# EAGLE design Midi2CV (EAGLE 6.2)
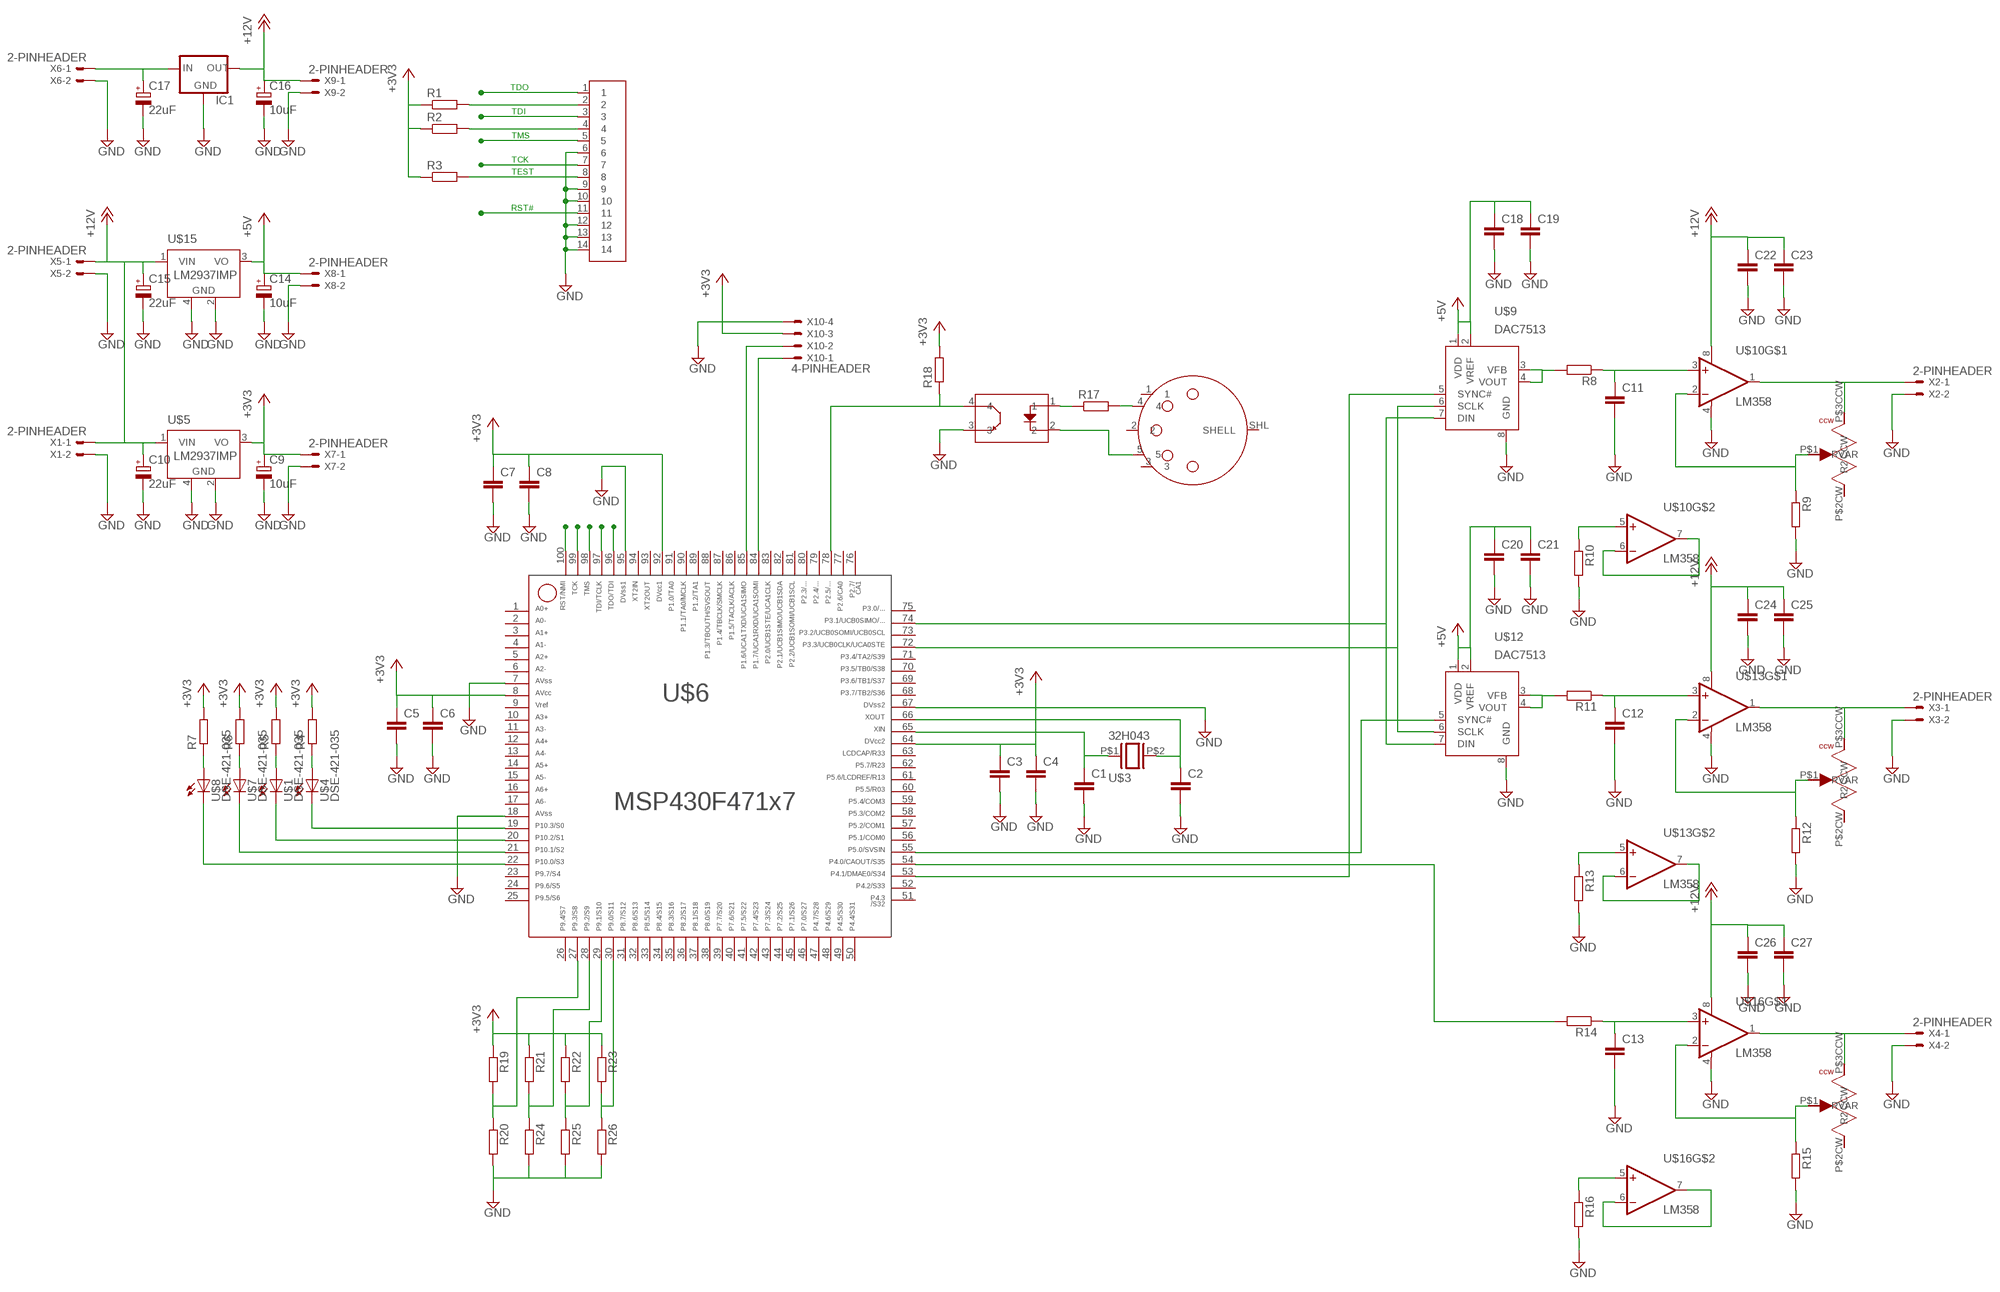
[diagram p0: schematic, sheet 1]

## Parts
C1  C-EUC0402  [C0402]
C2  C-EUC0402  [C0402]
C3  C-EUC0402  [C0402]
C4  C-EUC0402  [C0402]
C5  C-EUC0402  [C0402]
C6  C-EUC0402  [C0402]
C7  C-EUC0402  [C0402]
C8  C-EUC0402  [C0402]
C9  10uF  CPOL-EUSMCC  [SMC_C]
C10  22uF  CPOL-EUSMCD  [SMC_D]
C11  C-EUC0402  [C0402]
C12  C-EUC0402  [C0402]
C13  C-EUC0402  [C0402]
C14  10uF  CPOL-EUSMCC  [SMC_C]
C15  22uF  CPOL-EUSMCD  [SMC_D]
C16  10uF  CPOL-EUSMCC  [SMC_C]
C17  22uF  CPOL-EUSMCD  [SMC_D]
C18  C-EUC0402  [C0402]
C19  C-EUC0402  [C0402]
C20  C-EUC0402  [C0402]
C21  C-EUC0402  [C0402]
C22  C-EUC0402  [C0402]
C23  C-EUC0402  [C0402]
C24  C-EUC0402  [C0402]
C25  C-EUC0402  [C0402]
C26  C-EUC0402  [C0402]
C27  C-EUC0402  [C0402]
IC1  78MXXS  [78MXXS]
R1  R-EU_R0402  [R0402]
R2  R-EU_R0402  [R0402]
R3  R-EU_R0402  [R0402]
R4  R-EU_R0402  [R0402]
R5  R-EU_R0402  [R0402]
R6  R-EU_R0402  [R0402]
R7  R-EU_R0402  [R0402]
R8  R-EU_R0402  [R0402]
R9  R-EU_R0402  [R0402]
R10  R-EU_R0402  [R0402]
R11  R-EU_R0402  [R0402]
R12  R-EU_R0402  [R0402]
R13  R-EU_R0402  [R0402]
R14  R-EU_R0402  [R0402]
R15  R-EU_R0402  [R0402]
R16  R-EU_R0402  [R0402]
R17  R-EU_R1206  [R1206]
R18  R-EU_R1206  [R1206]
R19  R-EU_R0402  [R0402]
R20  R-EU_R0402  [R0402]
R21  R-EU_R0402  [R0402]
R22  R-EU_R0402  [R0402]
R23  R-EU_R0402  [R0402]
R24  R-EU_R0402  [R0402]
R25  R-EU_R0402  [R0402]
R26  R-EU_R0402  [R0402]
U$1  DSE-421-035  [2432]
U$2  2X7SMD_HEADER  [2X14SMDPADS]
U$3  32H043  [XTAL-SMALL-4]
U$4  DSE-421-035  [2432]
U$5  LM2937IMP  [SOT223]
U$6  F471X7---PZ100  [PZ100]
U$7  DSE-421-035  [2432]
U$8  DSE-421-035  [2432]
U$9  DAC7513  [MSOP08]
U$10  LM358  [SO08]
U$11  SMD-POT  [POT_PADS]
U$12  DAC7513  [MSOP08]
U$13  LM358  [SO08]
U$14  SMD-POT  [POT_PADS]
U$15  LM2937IMP  [SOT223]
U$16  LM358  [SO08]
U$17  SMD-POT  [POT_PADS]
U$19  F2801A  [LONG_TSOP]
U$20  MIDI_VERT  [DIN-5_VERT]
X1  2-PINHEADER  [22-23-2021]
X2  2-PINHEADER  [22-23-2021]
X3  2-PINHEADER  [22-23-2021]
X4  2-PINHEADER  [22-23-2021]
X5  2-PINHEADER  [22-23-2021]
X6  2-PINHEADER  [22-23-2021]
X7  2-PINHEADER  [22-23-2021]
X8  2-PINHEADER  [22-23-2021]
X9  2-PINHEADER  [22-23-2021]
X10  4-PINHEADER  [22-23-2041]

## Nets
+3V3: C3.1 C4.1 C5.1 C6.1 C7.1 C8.1 C9.+ R1.1 R2.1 R3.1 R4.2 R5.2 R6.2 R7.2 R18.2 R19.1 R21.1 R22.1 R23.1 U$5.3(VO) U$6.8 U$6.64 U$6.92 X7.1 X10.3
+5V: C14.+ C18.1 C19.1 C20.1 C21.1 U$9.1(VDD) U$9.2(VREF) U$12.1(VDD) U$12.2(VREF) U$15.3(VO) X8.1
+12V: C10.+ C15.+ C16.+ C22.1 C23.1 C24.1 C25.1 C26.1 C27.1 IC1.OUT U$5.1(VIN) U$10.8(V+) U$13.8(V+) U$15.1(VIN) U$16.8(V+) X1.1 X5.1 X9.1
GND: C1.2 C2.2 C3.2 C4.2 C5.2 C6.2 C7.2 C8.2 C9.- C10.- C11.2 C12.2 C13.2 C14.- C15.- C16.- C17.- C18.2 C19.2 C20.2 C21.2 C22.2 C23.2 C24.2 C25.2 C26.2 C27.2 IC1.GND R9.2 R10.2 R12.2 R13.2 R15.2 R16.2 R20.2 R24.2 R25.2 R26.2 U$2.6 U$2.9 U$2.10 U$2.12 U$2.13 U$2.14 U$5.2(GND) U$5.4(GND) U$6.7 U$6.18 U$6.67 U$6.95 U$9.8(GND) U$10.4(V-) U$12.8(GND) U$13.4(V-) U$15.2(GND) U$15.4(GND) U$16.4(V-) U$19.3 X1.2 X2.2 X3.2 X4.2 X5.2 X6.2 X7.2 X8.2 X9.2 X10.4
N$1: R1.2 U$2.2
N$2: C1.1 U$3.P$1 U$6.65
N$3: C2.1 U$3.P$2 U$6.66
N$4: R2.2 U$2.4
N$5: U$6.22 U$8.MARKED(C)
N$6: U$6.21 U$7.MARKED(C)
N$7: U$1.MARKED(C) U$6.20
N$8: U$4.MARKED(C) U$6.19
N$9: R7.1 U$8.P$1(A)
N$10: R6.1 U$7.P$1(A)
N$11: R5.1 U$1.P$1(A)
N$12: R4.1 U$4.P$1(A)
N$13: U$6.84 X10.1
N$14: R8.2 U$9.3(VFB) U$9.4(VOUT)
N$15: U$10.6(-IN) U$10.7(OUT)
N$16: C11.1 R8.1 U$10.3(+IN)
N$17: R9.1 U$10.2(-IN) U$11.P$1(RVAR)
N$18: U$10.1(OUT) U$11.P$3CCW(CCW) X2.1
N$19: R11.2 U$12.3(VFB) U$12.4(VOUT)
N$20: R10.1 U$10.5(+IN)
N$21: U$13.6(-IN) U$13.7(OUT)
N$22: C12.1 R11.1 U$13.3(+IN)
N$23: R12.1 U$13.2(-IN) U$14.P$1(RVAR)
N$24: U$13.1(OUT) U$14.P$3CCW(CCW) X3.1
N$25: R13.1 U$13.5(+IN)
N$26: R14.2 U$6.54
N$27: U$16.6(-IN) U$16.7(OUT)
N$28: C13.1 R14.1 U$16.3(+IN)
N$29: R15.1 U$16.2(-IN) U$17.P$1(RVAR)
N$30: U$16.1(OUT) U$17.P$3CCW(CCW) X4.1
N$31: R16.1 U$16.5(+IN)
N$32: U$6.85 X10.2
N$34: U$6.72 U$9.6(SCLK) U$12.6(SCLK)
N$35: U$6.74 U$9.7(DIN) U$12.7(DIN)
N$36: R17.2 U$20.4
N$37: U$6.53 U$9.5(SYNC#)
N$38: U$6.55 U$12.5(SYNC#)
N$39: R17.1 U$19.1
N$40: U$19.2 U$20.5
N$41: R18.1 U$6.78 U$19.4
N$42: C17.+ IC1.IN X6.1
N$43: R19.2 R20.1 U$6.27
N$44: R21.2 R24.1 U$6.28
N$45: R22.2 R25.1 U$6.29
N$46: R23.2 R26.1 U$6.30
RST#: U$2.11 U$6.100
TCK: U$2.7 U$6.99
TDI: U$2.3 U$6.97
TDO: U$2.1 U$6.96
TEST: R3.2 U$2.8
TMS: U$2.5 U$6.98
Unconnected: U$6.1 U$6.2 U$6.3 U$6.4 U$6.5 U$6.6 U$6.9 U$6.10 U$6.11 U$6.12 U$6.13 U$6.14 U$6.15 U$6.16 U$6.17 U$6.23 U$6.24 U$6.25 U$6.26 U$6.31 U$6.32 U$6.33 U$6.34 U$6.35 U$6.36 U$6.37 U$6.38 U$6.39 U$6.40 U$6.41 U$6.42 U$6.43 U$6.44 U$6.45 U$6.46 U$6.47 U$6.48 U$6.49 U$6.50 U$6.51 U$6.52 U$6.56 U$6.57 U$6.58 U$6.59 U$6.60 U$6.61 U$6.62 U$6.63 U$6.68 U$6.69 U$6.70 U$6.71 U$6.73 U$6.75 U$6.76 U$6.77 U$6.79 U$6.80 U$6.81 U$6.82 U$6.83 U$6.86 U$6.87 U$6.88 U$6.89 U$6.90 U$6.91 U$6.93 U$6.94 U$11.P$2CW(R2) U$14.P$2CW(R2) U$17.P$2CW(R2) U$20.1 U$20.2 U$20.3 U$20.SHL(SHELL)

## Notes on the sheet
- TDO
- TDI
- TMS
- TCK
- TEST
- RST#

## Library data of the parts
C1-C8 C11-C13 C18-C27 = rcl:C-EU: CAPACITOR, European symbol
C9 C10 C14-C17 = rcl:CPOL-EU: POLARIZED CAPACITOR, European symbol
IC1 = v-reg:78MXXS: VOLTAGE REGULATOR
R1-R26 = rcl:R-EU_: RESISTOR, European symbol
U$1 U$4 U$7 U$8 = synth_design:DSE-421-035
U$2 = synth_design:2X7SMD_HEADER
U$3 = synth_design:32H043
U$5 U$15 = synth_design:LM2937IMP
U$6 = TI_MSP430_v16:F471X7---PZ100: ***MSP430F471x7***PZ100
U$9 U$12 = synth_design:DAC7513
U$10 U$13 U$16 = synth_design:LM358
U$11 U$14 U$17 = synth_design:SMD-POT
U$19 = synth_design:F2801A
U$20 = synth_design:MIDI_VERT
X1-X9 = Custom_headers:2-PINHEADER: .100" (2.54mm) Center Header - 2 Pin; MF: MOLEX; MPN: 22-23-2021; OC_FARNELL: 1462926; OC_NEWARK: 25C3832
X10 = Custom_headers:4-PINHEADER: .100" (2.54mm) Center Header - 4 Pin; MF: MOLEX; MPN: 22-23-2041; OC_FARNELL: 1462920; OC_NEWARK: 38C0355

## Board
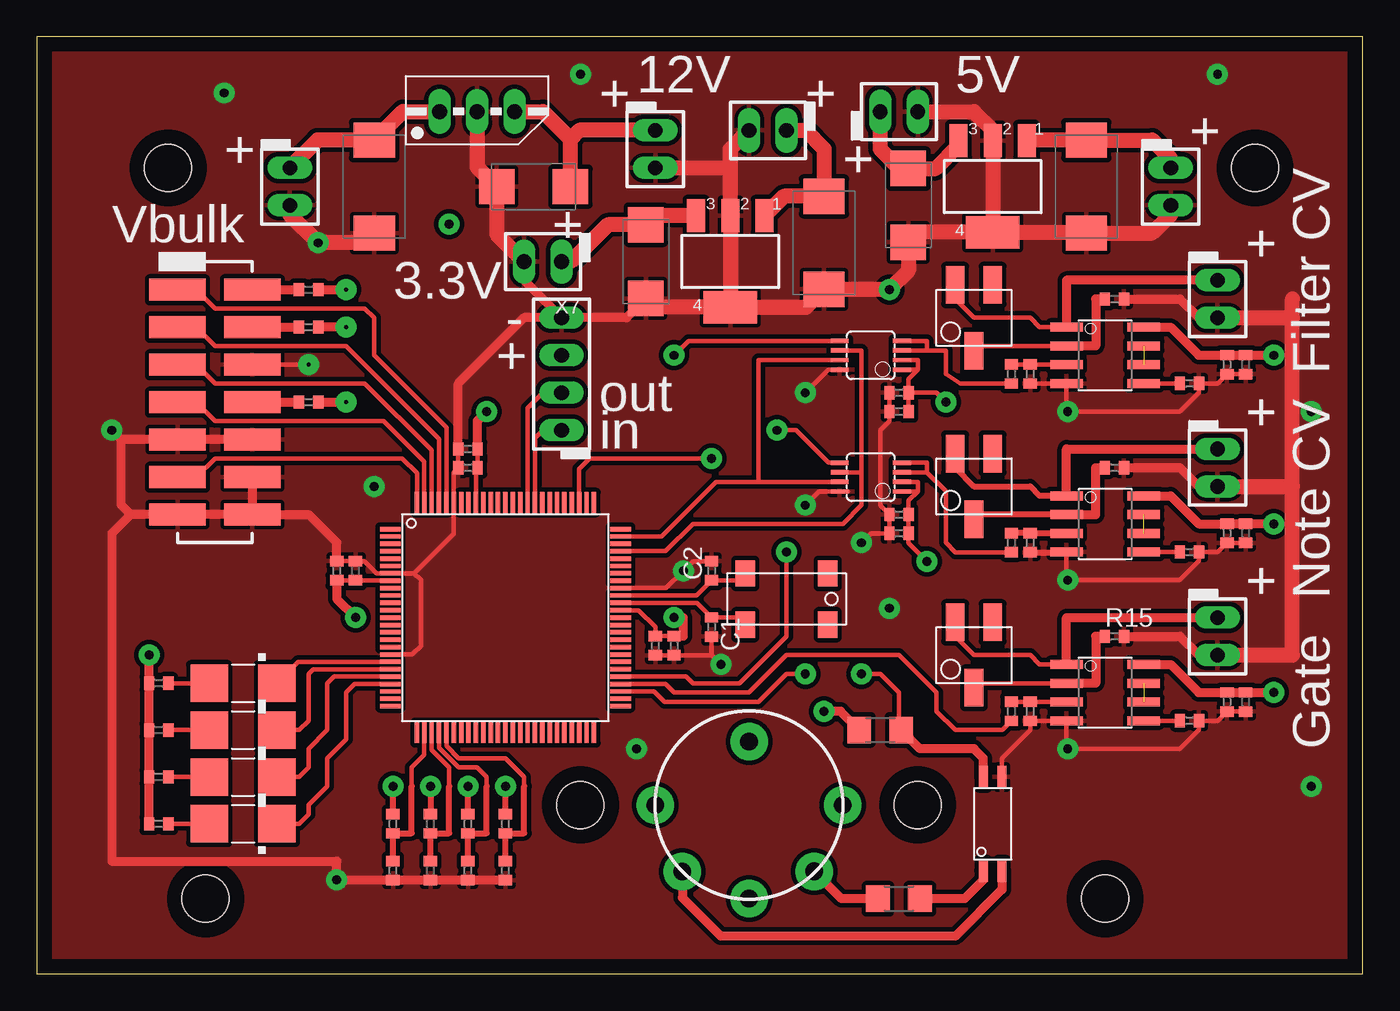
[diagram p1: board, top side]
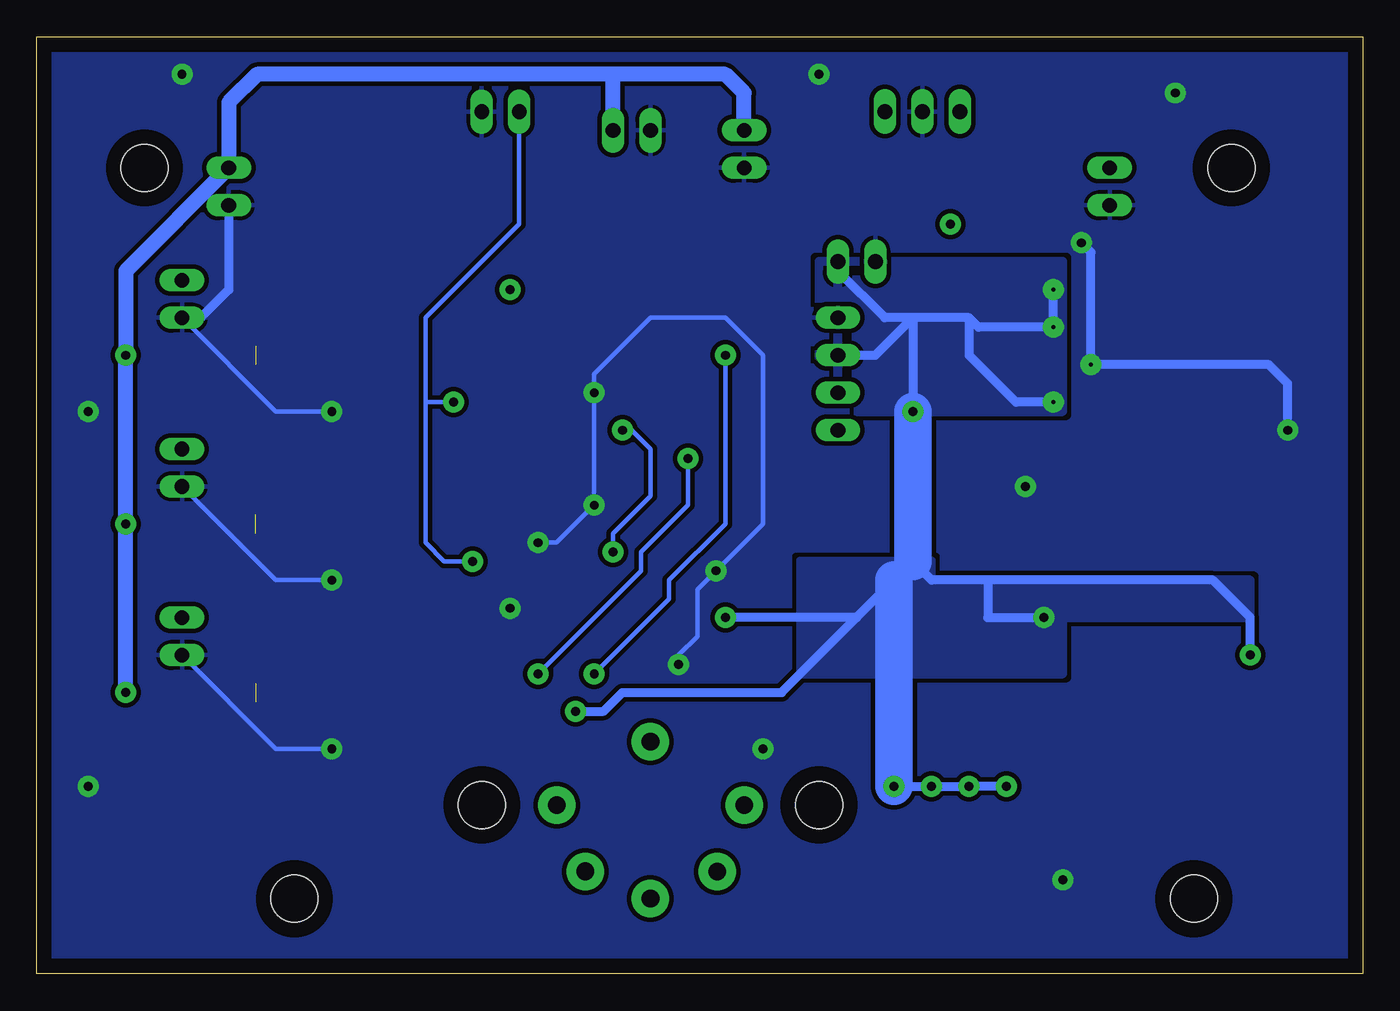
[diagram p2: board, bottom side, seen from below]

Size 89.84 x 63.49 mm. Coordinates in mm from the lower left corner, seen from the top.
Outline: 0,0 89.84,0 89.84,63.49 0,63.49 0,0
Copper layers (1*16): Top 0.035mm / dielectric 1.5mm / Bottom 0.035mm
Design rules: minimum track width 10mil, minimum drill 24mil, track to track 12mil, track to pad 12mil, pad to pad 12mil, via to via 12mil, smd to smd 12mil, copper to edge 40mil, drill to drill 8mil, minimum pad ring 10mil, minimum via ring 8mil, stop-mask expansion 4mil, vias tented up to drill 0mil, thermal gap 10mil
Holes 3.17 mm at 8.89,54.61 72.39,5.08 36.83,11.43 11.43,5.08 59.69,11.43 82.55,54.61

### Footprints (pad centres in the part's own frame; a part is rotated, then mirrored left to right if it is on the bottom)
C0402 = smd 0.7 x 0.9: 1 -0.65,0; 2 0.65,0
SMC_C = smd 2.4 x 2.4: + -2.5,0; - 2.5,0
SMC_D = smd 2.4 x 2.8: + -3.15,0; - 3.15,0
78MXXS = drill 1.016 long: GND 0,-2.54; IN -2.54,-2.54; OUT 2.54,-2.54
R0402 = smd 0.7 x 0.9: 1 -0.65,0; 2 0.65,0
R1206 = smd 1.6 x 1.803: 1 -1.422,0; 2 1.422,0
2432 = smd 2.54 x 2.54: MARKED 2.286,0; P$1 -2.286,0
2X14SMDPADS = smd 3.81 x 1.499: 1 -2.54,7.62; 2 2.54,7.62; 3 -2.54,5.08; 4 2.54,5.08; 5 -2.54,2.54; 6 2.54,2.54; 7 -2.54,0; 8 2.54,0; 9 -2.54,-2.54; 10 2.54,-2.54; 11 -2.54,-5.08; 12 2.54,-5.08; 13 -2.54,-7.62; 14 2.54,-7.62
XTAL-SMALL-4 = smd 1.778 x 1.295: NC1 -1.753,-2.794; NC2 1.727,-2.794; P$1 -1.753,2.794; P$2 1.727,2.794
SOT223 = smd 1.219 x 2.235: 1 -2.311,-3.099; 2 0,-3.099; 3 2.311,-3.099 | smd 3.6 x 2.2: 4 0,3.099
PZ100 = smd 1.4 x 0.3: 1 -7.8,6; 2 -7.8,5.5; 3 -7.8,5; 4 -7.8,4.5; 5 -7.8,4; 6 -7.8,3.5; 7 -7.8,3; 8 -7.8,2.5; 9 -7.8,2; 10 -7.8,1.5; 11 -7.8,1; 12 -7.8,0.5; 13 -7.8,0; 14 -7.8,-0.5; 15 -7.8,-1; 16 -7.8,-1.5; 17 -7.8,-2; 18 -7.8,-2.5; 19 -7.8,-3; 20 -7.8,-3.5; 21 -7.8,-4; 22 -7.8,-4.5; 23 -7.8,-5; 24 -7.8,-5.5; 25 -7.8,-6; 51 7.8,-6; 52 7.8,-5.5; 53 7.8,-5; 54 7.8,-4.5; 55 7.8,-4; 56 7.8,-3.5; 57 7.8,-3; 58 7.8,-2.5; 59 7.8,-2; 60 7.8,-1.5; 61 7.8,-1; 62 7.8,-0.5; 63 7.8,0; 64 7.8,0.5; 65 7.8,1; 66 7.8,1.5; 67 7.8,2; 68 7.8,2.5; 69 7.8,3; 70 7.8,3.5; 71 7.8,4; 72 7.8,4.5; 73 7.8,5; 74 7.8,5.5; 75 7.8,6 | smd 0.3 x 1.4: 26 -6,-7.8; 27 -5.5,-7.8; 28 -5,-7.8; 29 -4.5,-7.8; 30 -4,-7.8; 31 -3.5,-7.8; 32 -3,-7.8; 33 -2.5,-7.8; 34 -2,-7.8; 35 -1.5,-7.8; 36 -1,-7.8; 37 -0.5,-7.8; 38 0,-7.8; 39 0.5,-7.8; 40 1,-7.8; 41 1.5,-7.8; 42 2,-7.8; 43 2.5,-7.8; 44 3,-7.8; 45 3.5,-7.8; 46 4,-7.8; 47 4.5,-7.8; 48 5,-7.8; 49 5.5,-7.8; 50 6,-7.8; 76 6,7.8; 77 5.5,7.8; 78 5,7.8; 79 4.5,7.8; 80 4,7.8; 81 3.5,7.8; 82 3,7.8; 83 2.5,7.8; 84 2,7.8; 85 1.5,7.8; 86 1,7.8; 87 0.5,7.8; 88 0,7.8; 89 -0.5,7.8; 90 -1,7.8; 91 -1.5,7.8; 92 -2,7.8; 93 -2.5,7.8; 94 -3,7.8; 95 -3.5,7.8; 96 -4,7.8; 97 -4.5,7.8; 98 -5,7.8; 99 -5.5,7.8; 100 -6,7.8
MSOP08 = smd 0.3 x 1.2: 1 -0.976,-2.113; 2 -0.326,-2.113; 3 0.324,-2.113; 4 0.974,-2.113; 5 0.974,2.112; 6 0.324,2.112; 7 -0.326,2.112; 8 -0.976,2.112
SO08 = smd 0.61 x 2.21: 1 -1.905,-2.616; 2 -0.635,-2.616; 3 0.635,-2.616; 4 1.905,-2.616; 5 1.905,2.616; 6 0.635,2.616; 7 -0.635,2.616; 8 -1.905,2.616
POT_PADS = smd 2.54 x 1.27: P$1 2.223,0; P$2CW -2.223,1.27; P$3CCW -2.223,-1.27
LONG_TSOP = smd 1.524 x 0.61: 1 -3.175,0.635; 2 -3.175,-0.635; 3 3.175,-0.635; 4 3.175,0.635
DIN-5_VERT = drill 1.2 pad 2.54: 1 0,-6.35; 2 -6.35,0; 3 0,6.35; 4 -4.496,-4.42; 5 -4.521,4.521; SHL 4.293,0
22-23-2021 = drill 1 long: 1 -1.27,0; 2 1.27,0
22-23-2041 = drill 1 long: 1 -3.81,0; 2 -1.27,0; 3 1.27,0; 4 3.81,0

### Placement (x,y rotation side)
C1  45.72,23.5 270 top
C2  45.72,27.3 90 top
C3  41.91,22.23 270 top
C4  43.18,22.23 270 top
C5  20.32,27.3 90 top
C6  21.59,27.3 90 top
C7  29.21,35.56 180 top
C8  29.21,34.29 180 top
C9  41.27,48.26 270 top
C10  53.34,49.53 270 top
C11  67.31,40.64 270 top
C12  67.31,29.21 270 top
C13  67.31,17.78 270 top
C14  59.05,52.07 270 top
C15  71.12,53.34 270 top
C16  33.66,53.34 180 top
C17  22.86,53.34 270 top
C18  58.42,31.11 180 top
C19  58.42,29.84 180 top
C20  58.42,38.1 180 top
C21  58.42,39.37 180 top
C22  80.64,41.27 270 top
C23  81.92,41.27 270 top
C24  80.64,29.84 270 top
C25  81.92,29.84 270 top
C26  80.64,18.41 270 top
C27  81.92,18.41 270 top
IC1  29.84,60.96 0 top
R1  18.41,46.35 180 top
R2  18.41,43.81 180 top
R3  18.41,38.73 180 top
R4  8.26,19.68 180 top
R5  8.26,16.51 180 top
R6  8.26,13.34 180 top
R7  8.26,10.16 180 top
R8  66.04,40.64 270 top
R9  73.03,45.72 0 top
R10  78.11,40.01 0 top
R11  66.04,29.21 270 top
R12  73.03,34.29 0 top
R13  78.11,28.57 0 top
R14  66.04,17.78 270 top
R15  73.03,22.86 0 top
R16  78.11,17.14 0 top
R17  58.42,5.08 180 top
R18  57.15,16.51 180 top
R19  24.13,10.16 270 top
R20  24.13,6.99 270 top
R21  26.67,10.16 270 top
R22  29.21,10.16 270 top
R23  31.75,10.16 270 top
R24  26.67,6.99 270 top
R25  29.21,6.99 270 top
R26  31.75,6.99 270 top
U$1  13.97,16.51 0 top
U$2  12.06,38.73 0 top
U$3  50.8,25.4 90 top
U$4  13.97,19.68 0 top
U$5  46.99,48.26 180 top
U$6  31.75,24.13 0 top
U$7  13.97,13.34 0 top
U$8  13.97,10.16 0 top
U$9  56.52,41.91 90 top
U$10  72.39,41.91 270 top
U$11  63.5,44.45 270 top
U$12  56.52,33.66 90 top
U$13  72.39,30.48 270 top
U$14  63.5,33.02 270 top
U$15  64.77,53.34 180 top
U$16  72.39,19.05 270 top
U$17  63.5,21.59 270 top
U$19  64.77,10.16 90 top
U$20  48.26,11.43 90 top
X1  49.53,57.15 180 top
X2  80.01,45.72 270 top
X3  80.01,34.29 270 top
X4  80.01,22.86 270 top
X5  76.83,53.34 270 top
X6  17.14,53.34 270 top
X7  34.29,48.26 180 top
X8  58.42,58.42 0 top
X9  41.91,55.88 270 top
X10  35.56,40.64 90 top

### Tracks (layer width: path | path; a pad name or v marks a point on that pad's centre or on a via)
+3V3  (via drill 0.25 pad 1.42, 0.6 pad 1.42)
  Top 0.305: C5.1 C6.1 23.93,26.66 U$6.8 | U$6.64 40.77,24.63 41.91,23.5 C3.1 C4.1 | U$6.92 29.75,34.18 C8.1 C7.1 | 7.61,21.57 v7.62,21.59 | 43.81,22.89 43.8,22.88 | 41.87,51.36 C9.+
  Top 0.406: R19.1 v24.13,12.7 | v26.67,12.7 R21.1 | R22.1 v29.21,12.7 | R23.1 v31.75,12.7
  Top 0.61: R7.2 R6.2 R5.2 R4.2 7.61,21.57 | R1.1 v20.95,46.35 | R3.1 v20.95,38.73 | C5.1 20.32,25.4 v21.59,24.13 | C7.1 29.86,37.48 v30.48,38.1 | C4.1 43.8,22.88 | 43.81,22.89 43.81,24.13 v43.18,24.13 | v20.95,43.81 R2.1 | R18.2 54.46,17.78 v53.34,17.78
  Top 1.016: U$5.3 41.87,51.36 | C9.+ 38.7,50.76 36.2,48.26 X7.1
  Bottom 0.61: v7.62,21.59 7.62,24.13 10.16,26.67 25.4,26.67 | 25.4,26.67 25.4,24.13 v21.59,24.13 | 25.4,26.67 29.21,26.67 30.48,27.94 31.75,26.67 34.29,24.13 | 30.48,44.45 v30.48,38.1 | 34.29,24.13 v43.18,24.13 | X10.3 33.02,41.91 30.48,44.45 | 26.67,44.45 26.67,41.91 23.5,38.73 v20.95,38.73 | 26.67,44.45 30.48,44.45 | v24.13,12.7 v26.67,12.7 v29.21,12.7 v31.75,12.7 | v53.34,17.78 51.44,17.78 50.16,19.05 39.37,19.05 34.29,24.13 | 30.48,44.45 32.38,44.45 35.56,47.62 X7.1 | 26.67,44.45 26.04,43.81 v20.95,43.81 v20.95,46.35
  Bottom 2.54: 30.48,27.94 v30.48,38.1 | v31.75,12.7 31.75,26.67
  pour Bottom: 7.62,26.67 29.21,26.67 29.21,27.94 38.1,27.94 38.1,20.32 20.32,20.32 20.32,24.13 7.62,24.13
  pour Bottom: 20.32,48.26 36.83,48.26 36.83,38.1 20.32,38.1
+5V  (via drill 0.6 pad 1.42)
  Top 0.305: U$12.1 59.69,32.68 | 59.69,32.68 59.69,33.33 U$12.2 | U$9.2 59.69,41.58 59.69,40.93 | 59.69,40.93 U$9.1 | v61.59,38.73 60.96,39.37 C21.1 | v60.33,27.94 59.07,29.2 C19.1 C18.1 59.07,32.06 59.69,32.68 | C21.1 59.07,39.99 59.05,40.01 59.05,40.3 59.69,40.93 | C20.1 C21.1 | U$15.3 62.46,56.11 | C14.+ 58.46,54.57
  Top 1.016: C14.+ 60.92,54.57 62.46,56.11 | 58.46,54.57 57.15,55.88 X8.1
  Bottom 0.305: v60.33,27.94 62.23,27.94 63.5,29.21 63.5,38.73 | v61.59,38.73 63.5,38.73 | 63.5,38.73 63.5,44.45 57.15,50.8 X8.1
+12V  (via drill 0.6 pad 1.42)
  Top 0.305: C26.1 | 83.81,19.07 v83.82,19.05 | 83.81,30.5 v83.82,30.48 | 83.81,41.92 v83.82,41.91 | C22.1 | C24.1 | X5.1 76.83,55.24 | 67.13,56.49 U$15.1
  Top 0.61: U$16.8 76.83,20.95 78.74,19.05 C26.1 | 83.81,19.07 C27.1 C26.1 | 83.81,30.5 C25.1 C24.1 | 83.81,41.92 C23.1 C22.1 | U$10.8 76.83,43.81 78.74,41.91 C22.1 | U$13.8 76.83,32.38 78.74,30.48 C24.1
  Top 1.016: C16.+ 36.16,56.55 | 76.83,55.24 75.59,56.49 C15.+ 67.13,56.49 | U$5.1 50.62,52.68 C10.+ 53.34,55.88 52.07,57.15 X1.1 | IC1.OUT 34.29,58.42 36.16,56.55 | X9.1 36.75,57.15 36.16,56.55
  Bottom 1.016: v83.82,19.05 v83.82,30.48 v83.82,41.91 83.82,47.62 X5.1 76.83,59.05 74.93,60.96 50.8,60.96 | X9.1 41.91,59.69 43.18,60.96 50.8,60.96 | X1.1 50.8,60.96
GND  (via drill 0.25 pad 1.42, 0.6 pad 1.42)
  Top 0.305: C5.2 C6.2 21.61,27.94 22.23,27.94 23.04,27.13 U$6.7 25.57,27.13 | U$2.6 v18.41,41.27 | C7.2 C8.2 28.25,33.98 U$6.95 28.25,29.8 25.57,27.13 | C4.2 | C11.2 U$10.4 69.77,38.18 v69.85,38.1 77.47,38.1 78.75,39.38 R10.2 80.03,40.01 C22.2 C23.2 | U$6.18 25.44,21.63 26.04,22.23 26.04,26.67 25.57,27.13 | U$13.4 69.77,26.75 v69.85,26.67 77.47,26.67 78.75,27.95 R13.2 80.03,28.57 C24.2 C25.2 | C27.2 C26.2 80.03,17.14 R16.2 78.75,16.52 77.47,15.24 v69.85,15.24 69.77,15.32 U$16.4 C13.2 67.31,16.51 65.41,14.61 U$19.3 | C1.2 45.72,21.59 | 45.72,21.59 v46.35,20.95 | C3.2 C4.2 | C4.2 45.7,21.57 45.72,21.59 | U$6.67 42.64,26.13 v43.81,27.3 44.45,27.94 45.7,27.94 C2.2 | 54.95,32.68 U$12.8 53,32.68 v52.07,31.75 | C21.2 C20.2 57.77,37.45 57.15,36.83 57.15,31.73 C18.2 C19.2 56.52,29.84 v55.88,29.21 | U$9.8 53.63,40.93 v52.07,39.37 | C17.- 22.2,49.53 | 41.87,45.16 C9.- | 59.73,50.24 C14.- | 71.07,50.24 C15.- | 64.77,57.15 U$15.2
  Top 0.406: C12.2 U$13.4
  Top 0.61: R12.2 77.47,34.29 78.74,33.02 X3.2 | R9.2 77.47,45.72 78.74,44.45 X2.2 | R15.2 77.47,22.86 78.74,21.59 X4.2 | X10.4 33.02,44.45 28.56,39.99 C7.2 | C5.2 20.32,29.21 18.41,31.11 U$2.14 | U$2.10 U$2.9 5.71,36.2 | 6.35,31.11 U$2.13 U$2.14 | 6.35,31.11 5.71,31.75 5.71,36.2 | U$2.12 U$2.14 | X10.4 33.02,46.99 X7.2 | X10.4 39.97,44.45 C9.- | 5.71,36.2 v5.08,36.83 | R26.2 R25.2 R24.2 R20.2 20.32,6.33 v20.32,6.35 20.32,7.62 5.08,7.62 5.08,29.84 6.35,31.11
  Top 1.016: X4.2 85.09,21.59 85.09,33.02 | 85.09,33.02 85.09,44.45 | 85.09,44.45 85.09,45.72 | X2.2 85.09,44.45 | X6.2 17.14,51.44 v19.05,49.53 22.2,49.53 | U$5.4 52.12,45.16 C10.- 57.81,46.38 59.05,47.62 C14.- | U$5.4 41.87,45.16 | U$15.4 59.73,50.24 | U$15.4 71.07,50.24 | C15.- 75.59,50.19 76.83,51.44 X5.2 | X8.2 63.5,58.42 64.77,57.15 | U$15.2 U$15.4 | U$5.4 U$5.2 46.99,54.61 | 46.99,54.61 46.99,55.88 X1.2 | X7.2 31.16,50.12 C16.- 29.84,54.65 IC1.GND | X9.2 46.99,54.61 | X3.2 85.09,33.02
  Bottom 0.305: v69.85,38.1 73.66,38.1 X2.2 | v69.85,26.67 73.66,26.67 X3.2 | v69.85,15.24 73.66,15.24 X4.2 | v46.35,20.95 46.35,21.59 45.09,22.86 45.09,26.04 v43.81,27.3 40.64,30.48 40.64,41.91 43.18,44.45 48.26,44.45 52.07,40.64 v52.07,39.37 v52.07,31.75 54.61,29.21 v55.88,29.21
  Bottom 0.61: v5.08,36.83 5.08,40.01 6.35,41.27 v18.41,41.27 18.41,48.9 v19.05,49.53 | X5.2 76.83,46.35 78.74,44.45 X2.2
  other vias: 12.7,59.69 36.83,60.96 80.01,60.96 86.36,38.1 22.86,33.02 40.64,15.24 57.78,24.77 86.36,12.7
  pour Bottom (rank 2): 0,63.5 90.17,63.5 90.17,0 0,0
  pour Top: 0,63.5 90.17,63.5 90.17,0 0,0
N$1
  Top 0.61: U$2.2 R1.2
N$2
  Top 0.305: U$3.P$1 47.51,24.14 C1.1 44.73,25.13 U$6.65
N$3
  Top 0.305: U$3.P$2 47.53,26.66 C2.1 44.7,25.63 U$6.66
N$4
  Top 0.61: U$2.4 R2.2
N$5
  Top 0.305: U$6.22 21.54,19.63 20.95,19.05 20.95,15.88 19.68,14.61 19.68,12.7 18.41,11.43 18.41,10.79 17.78,10.16 U$8.MARKED
N$6
  Top 0.305: U$6.21 20.13,20.13 19.68,19.68 19.68,16.51 18.41,15.24 18.41,13.97 17.78,13.34 U$7.MARKED
N$7
  Top 0.305: U$6.20 18.73,20.63 18.41,20.32 18.41,17.14 17.78,16.51 U$1.MARKED
N$8
  Top 0.305: U$6.19 17.7,21.13 U$4.MARKED
N$9
  Top 0.305: R7.1 U$8.P$1
N$10
  Top 0.305: R6.1 U$7.P$1
N$11
  Top 0.305: R5.1 U$1.P$1
N$12
  Top 0.305: R4.1 U$4.P$1
N$13
  Top 0.305: U$6.84 33.75,36.29 34.29,36.83 X10.1
N$14
  Top 0.305: U$9.4 60.33,42.88 60.33,42.23 | 60.33,42.23 U$9.3 | R8.2 62.57,39.99 61.59,40.64 61.59,42.23 60.33,42.23
N$15  (1 unrouted)
N$16
  Top 0.305: U$10.3 67.33,41.27 C11.1 R8.1
N$17
  Top 0.305: U$10.2 63.5,42.55 U$11.P$1
  Top 0.61: R9.1 71.75,45.72 71.75,42.55 U$10.2
N$18
  Top 0.305: U$11.P$3CCW 62.23,45.72 63.5,44.45 67.31,44.45 67.94,43.81 U$10.1
  Top 0.61: X2.1 69.77,46.99 U$10.1
N$19
  Top 0.305: U$12.3 60.33,33.98 | 60.33,33.98 60.33,34.63 U$12.4 | R11.2 62.24,28.56 61.59,29.21 61.59,32.71 60.33,33.98
N$20
  Top 0.305: U$10.5 R10.1
N$21  (1 unrouted)
N$22
  Top 0.406: U$13.3 67.31,29.84 C12.1 R11.1
N$23
  Top 0.406: U$13.2 63.82,31.11 U$14.P$1
  Top 0.61: U$13.2 71.75,31.11 71.75,34.29 R12.1
N$24
  Top 0.406: U$14.P$3CCW 62.23,34.29 63.5,33.02 67.31,33.02 67.94,32.38 U$13.1
  Top 0.61: U$13.1 69.77,35.56 X3.1
N$25
  Top 0.305: U$13.5 R13.1
N$26
  Top 0.305: U$6.54 42.6,19.63 43.18,19.05 48.26,19.05 50.8,21.59 58.42,21.59 60.96,19.05 60.96,17.78 62.23,16.51 65.42,16.51 R14.2 66.03,17.14
N$27  (1 unrouted)
N$28
  Top 0.305: U$16.3 67.33,18.41 C13.1 R14.1
N$29
  Top 0.305: U$16.2 63.82,19.68 U$17.P$1
  Top 0.61: R15.1 71.75,22.86 71.75,19.68 U$16.2
N$30
  Top 0.305: U$17.P$3CCW 62.23,22.86 63.5,21.59 67.31,21.59 67.94,20.95 U$16.1
  Top 0.61: U$16.1 69.77,24.13 X4.1
N$31
  Top 0.305: R16.1 U$16.5
N$32
  Top 0.305: U$6.85 33.25,38.33 34.29,39.37 X10.2
N$34
  Top 0.305: U$9.6 55.88,42.23 55.88,33.98 | U$12.6 55.88,33.98 | U$6.72 42.6,28.63 44.45,30.48 54.61,30.48 55.88,31.75 55.88,33.98
N$35
  Top 0.305: U$12.7 48.9,33.33 | 48.9,33.33 48.9,41.58 U$9.7 | U$6.74 42.33,29.63 46.03,33.33 48.9,33.33
N$36
  Top 0.61: R17.2 54.53,5.08 U$20.4
N$37  (via drill 0.6 pad 1.42)
  Top 0.305: U$9.5 44.15,42.88 v43.18,41.91 | U$6.53 41.83,19.13 42.55,18.41 48.9,18.41 50.8,20.32 v52.07,20.32
  Bottom 0.305: v43.18,41.91 43.18,30.48 46.99,26.67 46.99,25.4 v52.07,20.32
N$38  (via drill 0.6 pad 1.42)
  Top 0.305: v50.8,28.57 50.8,22.86 47.62,19.68 44.45,19.68 44.01,20.13 U$6.55 | U$12.5 53.64,34.63 51.44,36.83 v50.16,36.83
  Bottom 0.305: v50.16,36.83 49.53,36.83 48.26,35.56 48.26,32.38 50.8,29.84 v50.8,28.57
N$39
  Top 0.61: U$19.1 64.14,6.35 62.87,5.08 R17.1
N$40
  Top 0.61: U$19.2 65.41,5.71 62.23,2.54 46.35,2.54 43.74,5.16 U$20.5
N$41  (via drill 0.6 pad 1.42)
  Top 0.305: U$6.78 36.75,34.21 37.47,34.92 v45.72,34.92 | v55.88,20.32 57.15,20.32 58.42,19.05 58.42,16.66 R18.1
  Top 0.61: U$19.4 64.14,14.61 63.5,15.24 59.84,15.24 R18.1
  Bottom 0.305: v45.72,34.92 45.72,31.75 48.9,28.57 48.9,27.3 v55.88,20.32
N$42
  Top 0.305: 23.52,57.15 C17.+
  Top 1.016: C17.+ 19.02,56.49 X6.1 | 23.52,57.15 24.79,58.42 IC1.IN
N$43
  Top 0.305: 25.4,12.7 25.4,13.97 26.25,14.82 U$6.27
  Top 0.406: R20.1 R19.2 25.4,9.51 25.4,12.7
N$44
  Top 0.305: U$6.28 26.75,15.16 27.94,13.97 27.94,12.7
  Top 0.406: R24.1 R21.2 27.94,9.51 27.94,12.7
N$45
  Top 0.305: U$6.29 27.25,15.29 28.57,13.97 29.84,13.97 30.48,13.34 30.48,12.7
  Top 0.406: R25.1 R22.2 30.48,9.51 30.48,12.7
N$46
  Top 0.305: U$6.30 27.75,15.43 28.57,14.61 31.75,14.61 33.02,13.34 33.02,12.7
  Top 0.406: R26.1 R23.2 33.02,9.51 33.02,12.7
N$47  (via drill 0.6 pad 1.42)
  other vias: 27.94,50.8
N$49  (via drill 0.6 pad 1.42)
  other vias: 57.78,46.35
RST#
  Top 0.305: U$2.11 10.79,33.66 12.06,34.92 24.77,34.92 25.75,33.94 U$6.100
TCK
  Top 0.305: U$2.7 10.79,38.73 12.06,37.47 23.5,37.47 26.25,34.71 U$6.99
TDI
  Top 0.305: U$2.3 10.79,43.81 12.06,42.55 20.95,42.55 27.25,36.25 U$6.97
TDO
  Top 0.305: U$2.1 10.79,46.35 12.06,45.09 22.23,45.09 22.86,44.45 22.86,41.91 27.75,37.02 U$6.96
TEST
  Top 0.61: U$2.8 R3.2
TMS
  Top 0.305: U$2.5 10.79,41.27 12.06,40.01 22.23,40.01 26.75,35.48 U$6.98

### Text on the board
tNames: 12V | 5V | + | + | + | + | + | Vbulk | + | + | 3.3V | - | + | Filter CV | out | + | in | + | Note CV | Gate